# EAGLE schematic base (EAGLE 8.5.2)

## Sheet 1 of 2
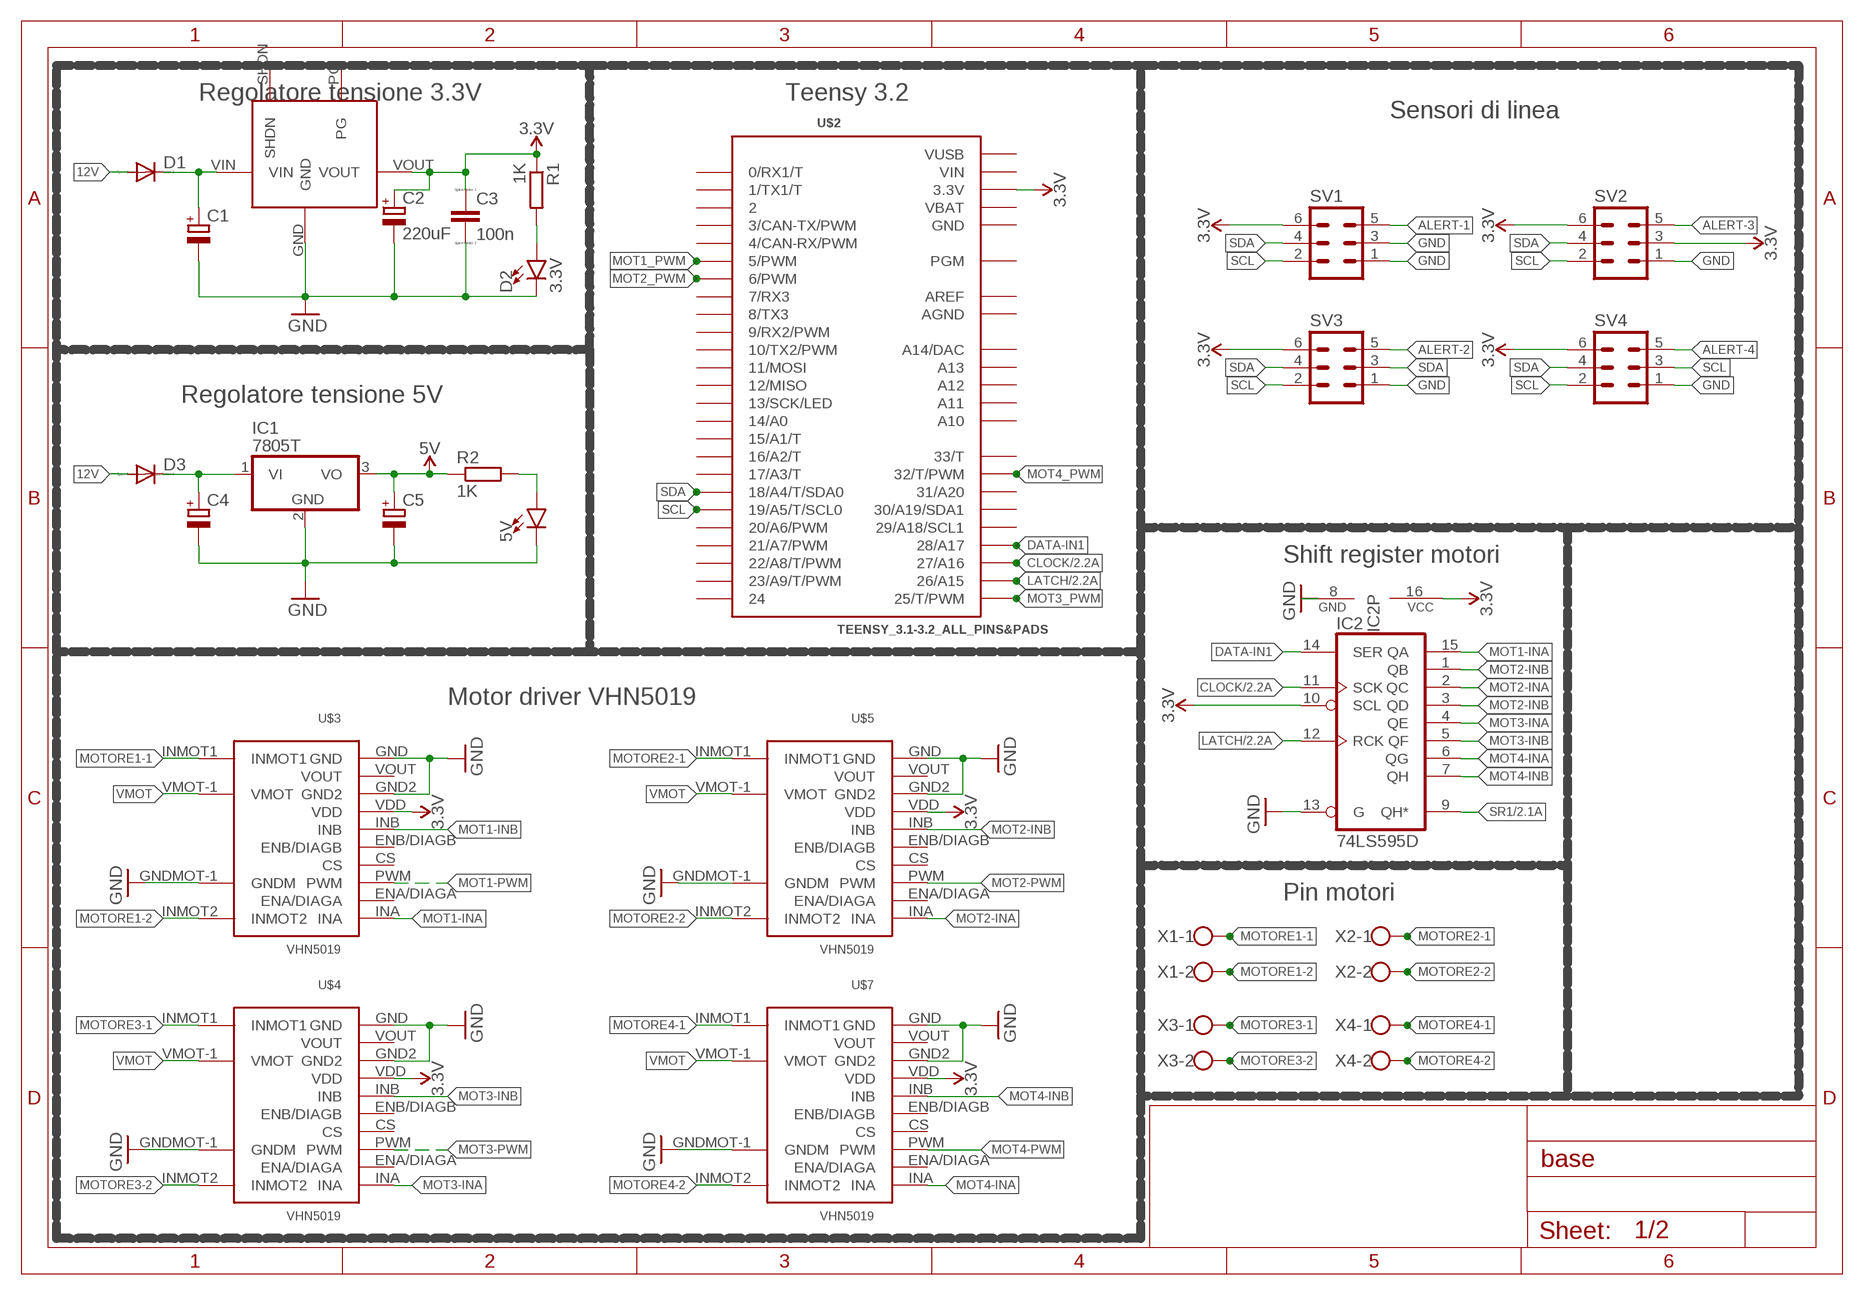
[diagram p0: schematic, sheet 1]

### Parts
5V  LED-FKIT-1206  [FKIT-LED-1206]
C1  CPOL-EUE5-8.5  [E5-8,5]
C2  220uF  CPOL-EUE5-8.5  [E5-8,5]
C3  100n  CC1206  [C1206]
C4  CPOL-EUE5-8.5  [E5-8,5]
C5  CPOL-EUE5-8.5  [E5-8,5]
D1  DIODE-SMB  [SMB]
D2  3.3V  LED-FKIT-1206  [FKIT-LED-1206]
D3  DIODE-SMB  [SMB]
IC1  7805T  [TO220H]
IC2  74LS595D  [SO16]
R1  1K  R-EU_M1206  [M1206]
R2  1K  R-EU_M1206  [M1206]
SV1  MA03-2  [MA03-2]
SV2  MA03-2  [MA03-2]
SV3  MA03-2  [MA03-2]
SV4  MA03-2  [MA03-2]
U$2  TEENSY_3.1-3.2_ALL_PINS&PADS  [TEENSY_3.0-3.2_ALL_PINS_&_PADS]
U$3  VHN5019  [MOTOR-SHIELD]
U$4  VHN5019  [MOTOR-SHIELD]
U$5  VHN5019  [MOTOR-SHIELD]
U$6  REGOLATORE-3.3V-1A  [REGOLATORE-3.3V-1A]
U$7  VHN5019  [MOTOR-SHIELD]
X1  W237-102  [W237-102]
X2  W237-102  [W237-102]
X3  W237-102  [W237-102]
X4  W237-102  [W237-102]

### Nets
3.3V: C2.+ C3.1 IC2.10(SCL) IC2.16(VCC) R1.1 SV1.6 SV2.3 SV2.6 SV3.6 SV4.6 U$2.3.3V U$2.3.3V1(3.3V) U$2.3.3V2(3.3V) U$3.VDD U$6.VOUT ; also sheet 2
5V: C5.+ IC1.3(VO) R2.1
12V: D1.A D3.A
ALERT-1: SV1.5
ALERT-2: SV3.5
ALERT-3: SV2.5
ALERT-4: SV4.5
CLOCK: IC2.11(SCK) U$2.27(27/A16) ; also sheet 2
DATA-IN1: IC2.14(SER) U$2.28(28/A17)
GND: 5V.C C1.- C2.- C3.2 C4.- C5.- D2.C IC1.2(GND) IC2.8(GND) IC2.13(G) SV1.1 SV1.3 SV2.1 SV3.1 SV4.1 U$4.GND U$4.GND2 U$4.GNDMOT-1(GNDM) U$5.GND U$5.GND2 U$5.GNDMOT-1(GNDM) U$6.GND U$7.GND U$7.GND2 U$7.GNDMOT-1(GNDM) ; also sheet 2
GND2: U$3.GND U$3.GND2 ; supply symbol labelled GND
GNDM: U$3.GNDMOT-1(GNDM) ; supply symbol labelled GND
LATCH: IC2.12(RCK) U$2.26(26/A15) ; also sheet 2
MOT1-INA: IC2.15(QA) U$3.INA
MOT1-INB: U$3.INB
MOT1-PWM: U$3.PWM
MOT1_PWM: U$2.5(5/PWM)
MOT2-INA: IC2.2(QC) U$5.INA
MOT2-INB: IC2.1(QB) IC2.3(QD) U$5.INB
MOT2-PWM: U$5.PWM
MOT2_PWM: U$2.6(6/PWM)
MOT3-INA: IC2.4(QE) U$4.INA
MOT3-INB: IC2.5(QF) U$4.INB
MOT3-PWM: U$4.PWM
MOT3_PWM: U$2.25(25/T/PWM)
MOT4-INA: IC2.6(QG) U$7.INA
MOT4-INB: IC2.7(QH) U$7.INB
MOT4-PWM: U$7.PWM
MOT4_PWM: U$2.32(32/T/PWM)
MOTORE1-1: U$3.INMOT1 X1.1
MOTORE1-2: U$3.INMOT2 X1.2
MOTORE2-1: U$5.INMOT1 X2.1
MOTORE2-2: U$5.INMOT2 X2.2
MOTORE3-1: U$4.INMOT1 X3.1
MOTORE3-2: U$4.INMOT2 X3.2
MOTORE4-1: U$7.INMOT1 X4.1
MOTORE4-2: U$7.INMOT2 X4.2
N$1: C1.+ D1.C U$6.VIN
N$2: D2.A R1.2
N$3: C4.+ D3.C IC1.1(VI)
N$4: 5V.A R2.2
SCL: SV1.2 SV2.2 SV3.2 SV4.2 SV4.3 U$2.19/A5(19/A5/T/SCL0)
SDA: SV1.4 SV2.4 SV3.3 SV3.4 SV4.4 U$2.18/A4(18/A4/T/SDA0)
SR1: IC2.9(QH*) ; also sheet 2
VDD: U$4.VDD U$5.VDD U$7.VDD ; supply symbol labelled 3.3V
VMOT: U$3.VMOT-1(VMOT) U$4.VMOT-1(VMOT) U$5.VMOT-1(VMOT) U$7.VMOT-1(VMOT)
Unconnected: U$2.0(0/RX1/T) U$2.1(1/TX1/T) U$2.2 U$2.3(3/CAN-TX/PWM) U$2.4(4/CAN-RX/PWM) U$2.7(7/RX3) U$2.8(8/TX3) U$2.9(9/RX2/PWM) U$2.10(10/TX2/PWM) U$2.11(11/MOSI) U$2.12(12/MISO) U$2.13(13/SCK/LED) U$2.14/A0 U$2.15/A1(15/A1/T) U$2.16/A2(16/A2/T) U$2.17/A3(17/A3/T) U$2.20/A6(20/A6/PWM) U$2.21/A7(21/A7/PWM) U$2.22/A8(22/A8/T/PWM) U$2.23/A9(23/A9/T/PWM) U$2.24 U$2.29(29/A18/SCL1) U$2.30(30/A19/SDA1) U$2.31(31/A20) U$2.33(33/T) U$2.A10 U$2.A11 U$2.A12 U$2.A13 U$2.PGM U$2.RESET/DAC(A14/DAC) U$3.CS U$3.ENA/DIAGA U$3.ENB/DIAGB U$3.VOUT U$4.CS U$4.ENA/DIAGA U$4.ENB/DIAGB U$4.VOUT U$5.CS U$5.ENA/DIAGA U$5.ENB/DIAGB U$5.VOUT U$6.PG U$6.SHDN U$7.CS U$7.ENA/DIAGA U$7.ENB/DIAGB U$7.VOUT

### Notes on the sheet
- Regolatore tensione 3.3V | Teensy 3.2
- Sensori di linea
- Regolatore tensione 5V
- Shift register motori
- Motor driver VHN5019
- Pin motori

## Sheet 2 of 2
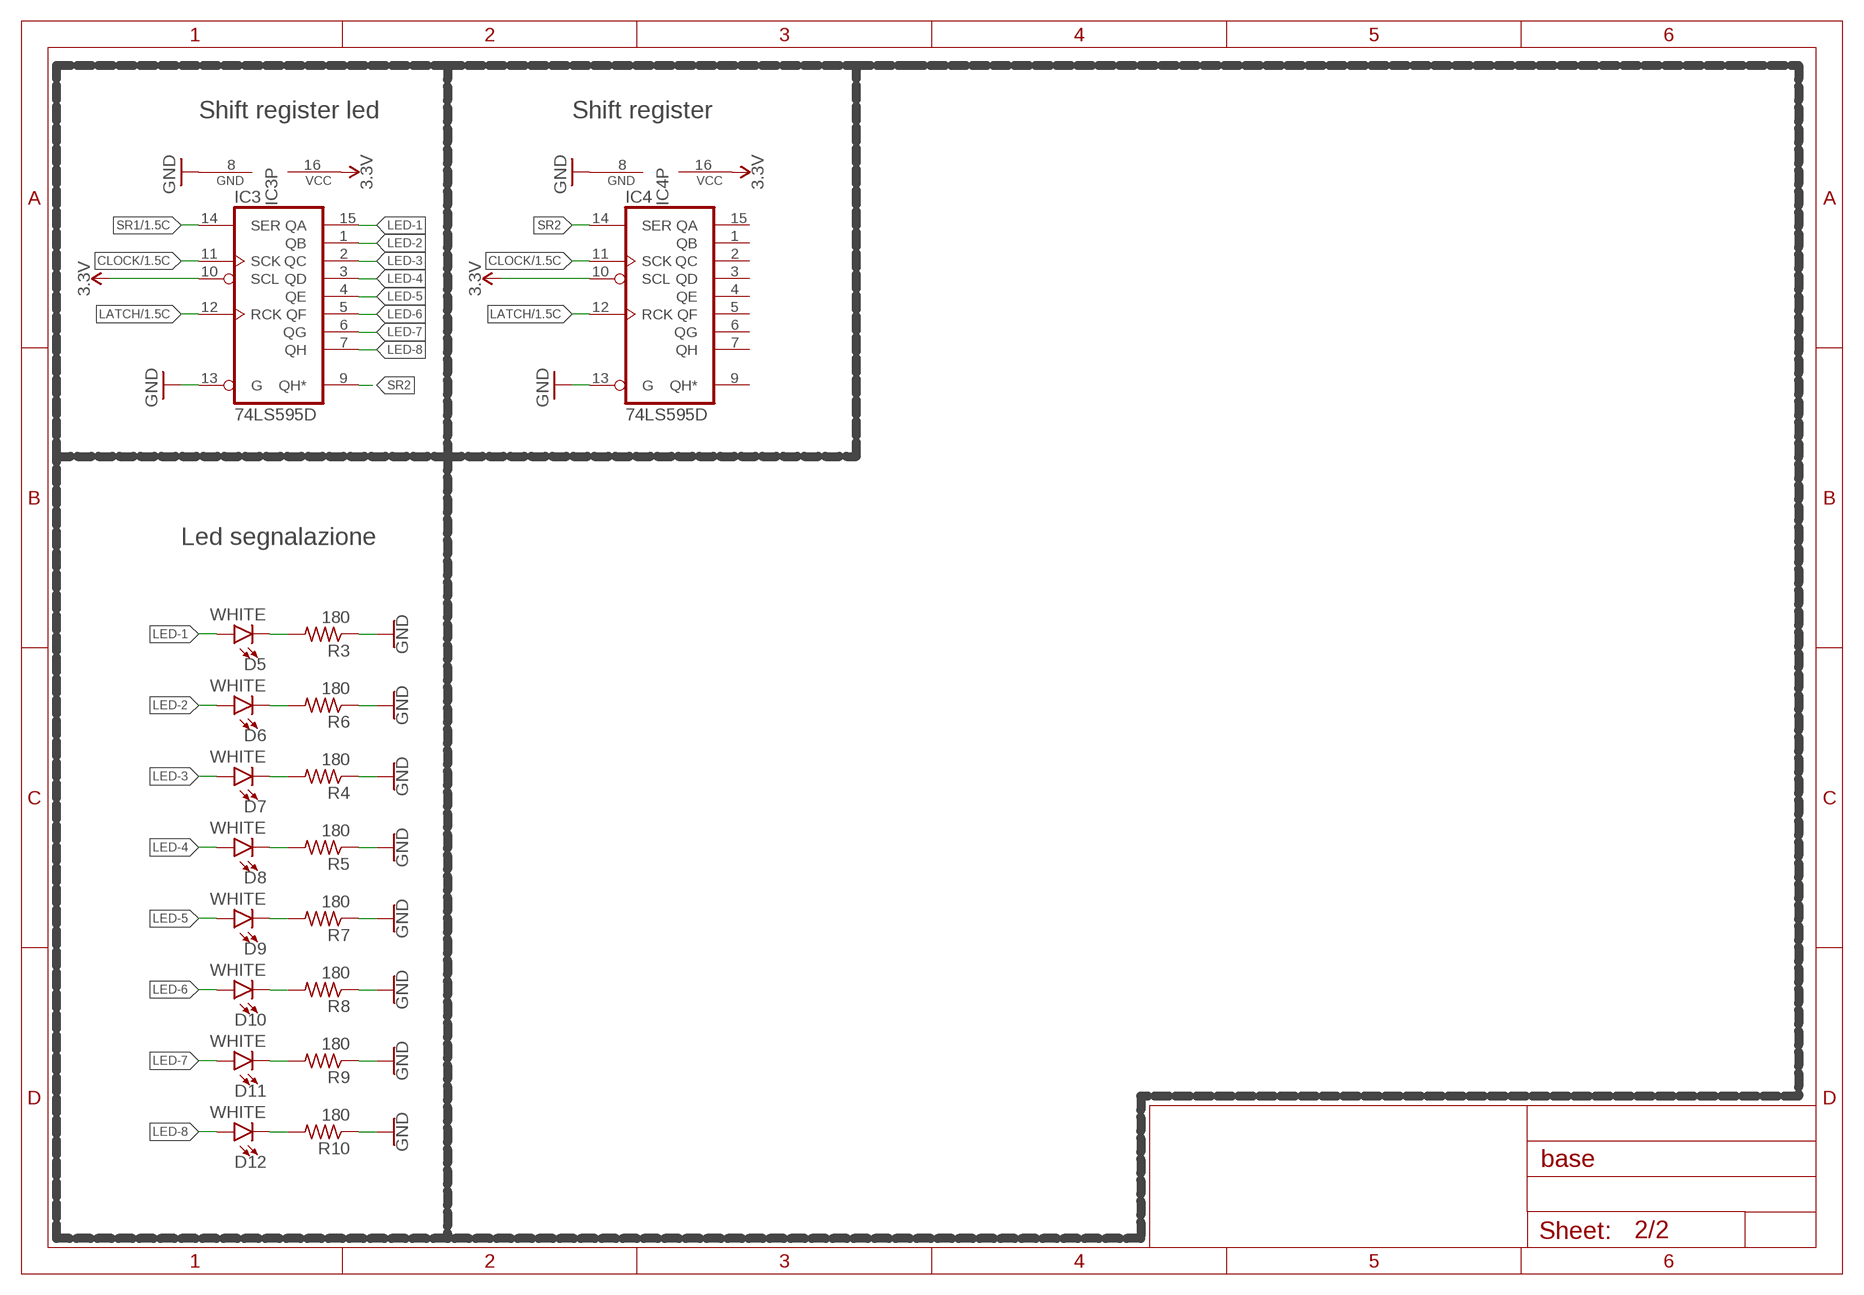
[diagram p1: schematic, sheet 2]

### Parts
D5  WHITE  LED-WHITE1206  [LED-1206]
D6  WHITE  LED-WHITE1206  [LED-1206]
D7  WHITE  LED-WHITE1206  [LED-1206]
D8  WHITE  LED-WHITE1206  [LED-1206]
D9  WHITE  LED-WHITE1206  [LED-1206]
D10  WHITE  LED-WHITE1206  [LED-1206]
D11  WHITE  LED-WHITE1206  [LED-1206]
D12  WHITE  LED-WHITE1206  [LED-1206]
IC3  74LS595D  [SO16]
IC4  74LS595D  [SO16]
R3  180  R-US_0204/7  [0204/7]
R4  180  R-US_0204/7  [0204/7]
R5  180  R-US_0204/7  [0204/7]
R6  180  R-US_0204/7  [0204/7]
R7  180  R-US_0204/7  [0204/7]
R8  180  R-US_0204/7  [0204/7]
R9  180  R-US_0204/7  [0204/7]
R10  180  R-US_0204/7  [0204/7]

### Nets
3.3V: IC3.10(SCL) IC3.16(VCC) IC4.10(SCL) IC4.16(VCC) ; also sheet 1
CLOCK: IC3.11(SCK) IC4.11(SCK) ; also sheet 1
GND: IC3.8(GND) IC3.13(G) IC4.8(GND) IC4.13(G) R3.1 R4.1 R5.1 R6.1 R7.1 R8.1 R9.1 R10.1 ; also sheet 1
LATCH: IC3.12(RCK) IC4.12(RCK) ; also sheet 1
LED-1: D5.A IC3.15(QA)
LED-2: D6.A IC3.1(QB)
LED-3: D7.A IC3.2(QC)
LED-4: D8.A IC3.3(QD)
LED-5: D9.A IC3.4(QE)
LED-6: D10.A IC3.5(QF)
LED-7: D11.A IC3.6(QG)
LED-8: D12.A IC3.7(QH)
N$7: D5.C R3.2
N$8: D6.C R6.2
N$9: D7.C R4.2
N$11: D8.C R5.2
N$12: D9.C R7.2
N$13: D10.C R8.2
N$14: D11.C R9.2
N$15: D12.C R10.2
SR1: IC3.14(SER) ; also sheet 1
SR2: IC3.9(QH*) IC4.14(SER)
Unconnected: IC4.1(QB) IC4.2(QC) IC4.3(QD) IC4.4(QE) IC4.5(QF) IC4.6(QG) IC4.7(QH) IC4.9(QH*) IC4.15(QA)

### Notes on the sheet
- Shift register led | Shift register
- Led segnalazione

## Power pins joined to a net without a drawn wire
AGND: U$2.AGND
AREF: U$2.AREF
GND: U$2.GND U$2.GND1(GND) U$2.GND2(GND)
VBAT: U$2.VBAT
VIN: U$2.VIN
VUSB: U$2.VUSB

## Library data of the parts
5V D2 = SparkFun-LED:LED: LED (Generic) Standard schematic elements and footprints for 5mm, 3mm, 1206, and 0603 sized LEDs. Generic LEDs with no color specified.
C1 C2 C4 C5 = resistor:CPOL-EU: POLARIZED CAPACITOR, European symbol
C3 = eagle-ltspice:C: CAPACITOR, European symbol; SPICEMODEL: NONE; SPICEPREFIX: C
D1 D3 = diode:DIODE-: DIODE
D5-D12 = SparkFun-LED:LED-WHITE: White SMD LED Used in manufacturing several products at SparkFun. Packages: 0603 - Bright White SMD 0603 package[Product Link] <http://www.kingbrightusa.com/product.asp?catalog_name=LED&product_id=APT1608QWF/D> 1206 - Bright White SMD1206 package [Product Link] <http://www.kingbrightusa.com/product.asp?catalog_name=LED&product_id=APT3216QWF/D> 3014 - Super Bright SMD 3014 package [Datasheet] <http://www.lumileds.com/uploads/459/DS208-pdf> SparkFun Products: Blackberry Trackballer Breakout <https://www.sparkfun.com/products/13169> Digital SandBox <https://www.sparkfun.com/products/12651>; PROD_ID: DIO-09955
IC1 = linear:78*: Positive VOLTAGE REGULATOR Source: http://cache.national.com/ds/LM/LM78L05.pdf http://www.fairchildsemi.com/ds/LM/LM7805.pdf
IC2-IC4 = 74xx-us:74*595: 8-bit SHIFT REGISTER, output latch
R1 R2 = resistor:R-EU_: RESISTOR, European symbol
R3-R10 = rcl:R-US_: RESISTOR, American symbol; SPICEPREFIX: R
SV1-SV4 = con-lstb:MA03-2: PIN HEADER; OC_FARNELL: unknown; OC_NEWARK: unknown
U$2 = Teensy_3_and_LC_Series_Boards_v1.4:TEENSY_3.1-3.2_ALL_PINS&PADS: Footprint for Teensy 3.1 or 3.2 board using all pads and all through-holes. Pads need a 2x7 0.1" SMD header.
U$3-U$5 U$7 = VHN5019:VHN5019: Operating voltage: 5.5 – 24 V1 Output current: 12 A continuous (30 maximum) 3V-compatible inputs PWM operation up to 20 kHz, which is ultrasonic and allows for quieter motor operation Current sense output proportional to motor current (approx. 140 mV/A) Motor indicator LEDs (indicates what the outputs are doing even when no motor is connected) Robust: Reverse-voltage protection Can survive input voltages up to 41 V Undervoltage and overvoltage shutdown High-side and low-side thermal shutdown Short-to-ground and short-to-Vcc protection; MOTOR: motor
U$6 = libreria valerio:REGOLATORE-3.3V-1A: regolatore di tensione da 12V a 3,3 V
X1-X4 = con-wago-500:W237-102: WAGO SCREW CLAMP; MPN: 237-102; OC_FARNELL: unknown; OC_NEWARK: 70K9898